# Altium schematic sheet MCU.SchDoc: MCU
size 279 x 215 mm; Engineer: JGao; Revision: 1.1; SheetNumber: 2; SheetTotal: 3
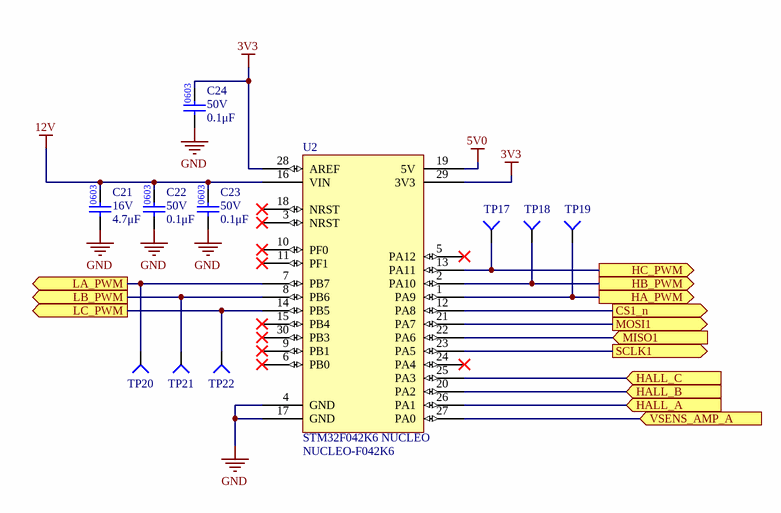
[diagram p0: MCU.SchDoc]

## Parts
C21  value 4.7μF  Voltage Rating: 16V  [CAP0603]  (hidden comment: CAP_4.7uF_16V_0603)
C22  value 0.1μF  Voltage Rating: 50V  [CAP0603]  (hidden comment: CAP_0.1uF_50V_0603)
C23  value 0.1μF  Voltage Rating: 50V  [CAP0603]  (hidden comment: CAP_0.1uF_50V_0603)
C24  value 0.1μF  Voltage Rating: 50V  [CAP0603]  (hidden comment: CAP_0.1uF_50V_0603)
TP17  TESTPOINT_1MM_CIRCLE  [TESTPOINT_CIRCLE_1MM]  (value not drawn)  (no BOM)
TP18  TESTPOINT_1MM_CIRCLE  [TESTPOINT_CIRCLE_1MM]  (value not drawn)  (no BOM)
TP19  TESTPOINT_1MM_CIRCLE  [TESTPOINT_CIRCLE_1MM]  (value not drawn)  (no BOM)
TP20  TESTPOINT_1MM_CIRCLE  [TESTPOINT_CIRCLE_1MM]  (value not drawn)  (no BOM)
TP21  TESTPOINT_1MM_CIRCLE  [TESTPOINT_CIRCLE_1MM]  (value not drawn)  (no BOM)
TP22  TESTPOINT_1MM_CIRCLE  [TESTPOINT_CIRCLE_1MM]  (value not drawn)  (no BOM)
U2  STM32F042K6 NUCLEO  [NUCLEO-F042K6]

## Ports
CS1_n (out), HA_PWM (out), HALL_A (in), HALL_B (in), HALL_C (in), HB_PWM (out), HC_PWM (out), LA_PWM (out), LB_PWM (out), LC_PWM (out), MISO1 (in), MOSI1 (out), SCLK1 (out), VSENS_AMP_A (in)

## Nets
3V3: C24.2 U2.28(AREF) U2.29(3V3)
5V0: U2.19(5V)
12V: C21.2 C22.2 C23.2 U2.16(VIN)
GND: C21.1 C22.1 C23.1 C24.1 U2.4(GND) U2.17(GND)
CS1_n: U2.12(PA8) ; port CS1_n
HA_PWM: TP19.1(=value) U2.1(PA9) ; port HA_PWM
HALL_A: U2.26(PA1) ; port HALL_A
HALL_B: U2.20(PA2) ; port HALL_B
HALL_C: U2.25(PA3) ; port HALL_C
HB_PWM: TP18.1(=value) U2.2(PA10) ; port HB_PWM
HC_PWM: TP17.1(=value) U2.13(PA11) ; port HC_PWM
LA_PWM: TP20.1(=value) U2.7(PB7) ; port LA_PWM
LB_PWM: TP21.1(=value) U2.8(PB6) ; port LB_PWM
LC_PWM: TP22.1(=value) U2.14(PB5) ; port LC_PWM
MISO1: U2.22(PA6) ; port MISO1
MOSI1: U2.21(PA7) ; port MOSI1
SCLK1: U2.23(PA5) ; port SCLK1
VSENS_AMP_A: U2.27(PA0) ; port VSENS_AMP_A

Not connected (* = marked no-connect by the designer): U2 3(NRST)* 5(PA12)* 6(PB0)* 9(PB1)* 10(PF0)* 11(PF1)* 15(PB4)* 18(NRST)* 24(PA4)* 30(PB3)*

## Notes on the sheet
- University of Waterloo Robotics Team
- 200 University Ave W
- REV
- PROJECT
- Waterloo, Ontario, Canada
- N2L 3G1
- DOCUMENT
- ENGINEER
- REVIEWER
- MODIFIED
- SHEET
- OF

## Library data of the parts
C21 = CAP_4.7uF_16V_0603: CAP CER 4.7UF 16V X6S 0603; Manufacturer Part Number 1: GRM188C81C475KE11D; Manufacturer 1: Murata Electronics; Supplier Part Number 1: 490-13362-1-ND; Supplier 1: Digi-Key; Mounting Type: SMD; Package: 0603; Dielectric: X6S
C22-C24 = CAP_0.1uF_50V_0603: CAP CER 0.1UF 50V X7R 0603; Manufacturer Part Number 1: CC0603KRX7R9BB104; Manufacturer 1: Yageo; Package/Footprint: 0603; Supplier Part Number 1: 311-1344-1-ND; Supplier 1: Digi-Key; Mounting Type: SMD; Dielectric: X7R
TP17-TP22 = TESTPOINT_1MM_CIRCLE: TESTPOINT 1MM CIRCLE
U2 = STM32F042K6-NUCLEO: STM32 Nucleo-32 development board with STM32F042K6 MCU, supports Arduino connectivity; Manufacturer: STMicroelectronics; Supplier 1: Digi-Key; RoHS: Yes; Category: Embedded Processors and Controllers; Stock 1: 10; Pricing 1: 1=10.99000 (USD); ComponentLink1URL: http://www.farnell.com/datasheets/1966773.pdf?src-supplier=Farnell; ComponentLink1Description: http://www.farnell.com/datasheets/1966773.pdf?src-supplier=Farnell; ComponentLink2URL: http://www.st.com/content/ccc/resource/technical/document/data_brief/b1/d8/13/d4/b0/b7/4b/6e/DM00214578.pdf/files/DM00214578.pdf/jcr:content/translations/en.DM00214578.pdf?src-supplier=Digi-Key; ComponentLink2Description: http://www.st.com/content/ccc/resource/technical/document/data_brief/b1/d8/13/d4/b0/b7/4b/6e/DM00214578.pdf/files/DM00214578.pdf/jcr:content/translations/en.DM00214578.pdf?src-supplier=Digi-Key; ComponentLink3URL: http://www.st.com/st-web-ui/static/active/en/resource/technical/document/user_manual/DM00119724.pdf?s_searchtype=keyword&src-supplier=Avnet; ComponentLink3Description: http://www.st.com/st-web-ui/static/active/en/resource/technical/document/user_manual/DM00119724.pdf?s_searchtype=keyword&src-supplier=Avnet; ComponentLink4URL: http://www.farnell.com/datasheets/1966773.pdf?src-supplier=Element14; ComponentLink4Description: http://www.farnell.com/datasheets/1966773.pdf?src-supplier=Element14; ComponentLink5URL: http://www.st.com/st-web-ui/static/active/en/resource/technical/document/user_manual/DM00119724.pdf?s_searchtype=keyword&src-supplier=Avnet+Asia; ComponentLink5Description: http://www.st.com/st-web-ui/static/active/en/resource/technical/document/user_manual/DM00119724.pdf?s_searchtype=keyword&src-supplier=Avnet+Asia; Supplier Part Number 1: 497-15980-ND; Manufacturer Part Number: NUCLEO-F042K6